# Altium schematic sheet Altium Images.SchDoc
size Letter; SheetNumber: 7; SheetTotal: 7
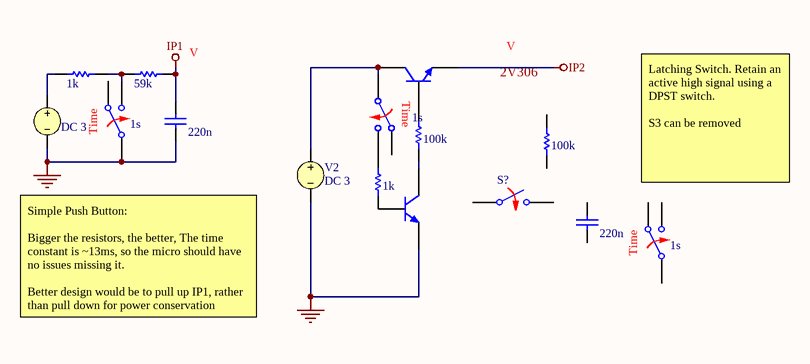
[diagram p0: Altium Images.SchDoc]

## Parts
(Parts that share a designator on the sheet are numbered #1, #2 ... from top to bottom, then left to right.)
C1  value 220n  (hidden comment: Capacitor)
C2  value 220n  (hidden comment: Capacitor)
Q1  Bipolar NPN 3 Pins Transistor VBIC Model  (value not drawn)
Q2  Bipolar NPN 3 Pins Transistor VBIC Model  (value not drawn)
R1  value 1k  (hidden comment: Resistor)
R2  value 59k  (hidden comment: Resistor)
R3  value 100k  (hidden comment: Resistor)
R4  value 100k  (hidden comment: Resistor)
R5  value 1k  (hidden comment: Resistor)
S2  ttran: 1s  (hidden comment: Time Controlled Switch)
S3  ttran: 1s  (hidden comment: Time Controlled Switch)
S?#1  ttran: 1s  (hidden comment: Time Controlled Switch)
S?#2  Switch Normally Opened  (value not drawn)
V1  DC 3
V2  DC 3

## Nets
GND: C1.1 Q2.3(E) S?#1.1 V1.2 V2.2
IP1: C1.2 R2.1
IP2: Q1.3(E)
NetQ1_1: Q1.1(C) S2.1 V2.1
NetQ1_2: Q1.2(B) R3.2
NetQ2_1: Q2.1(C) R3.1
NetQ2_2: Q2.2(B) R5.2
NetR1_1: R1.1 R2.2 S?#1.2
NetR1_2: R1.2 V1.1
NetR5_1: R5.1 S2.2

Not connected (* = marked no-connect by the designer): C2 1 2; R4 1 2; S2 3; S3 1 2 3; S?#1 3; S?#2 1 2

## Notes on the sheet
- 2V306
- Latching Switch. Retain an active high signal using a DPST switch.
  S3 can be removed
- Simple Push Button:
  Bigger the resistors, the better, The time constant is ~13ms, so the micro should have no issues missing it.
  Better design would be to pull up IP1, rather than pull down for power conservation
- (in symbol Time Controlled SW) Time

## Library data of the parts
C1 C2 = Capacitor: SimulationGenericComponent: True
Q1 Q2 = BJT NPN VBIC: SimulationGenericComponent: True; AFN: 1; AJC: -0.5; ART: 0.1; AVC1: 0; EA: 1.12; FC: 0.9; IBBE: 1e-06; IBCI: 1e-16; IBEI: 1e-18; MC: 0.33; NCN: 2; NKF: 0.5; PC: 0.75; TNOM: 27; VERS: 1.2; XII: 3; AJE: -0.5; AJS: -0.5; AVC2: 0; BFN: 1; CBCO: 0; CBEO: 0; CCSO: 0; CJC: 0; CJCP: 0; CJE: 0; CJEP: 0; CTH: 0; DEAR: 0; EAIC: 1.12; EAIE: 1.12; EAIS: 1.12; EANC: 1.12; EANE: 1.12; EANS: 1.12; EAP: 1.12; EBBE: 0; GAMM: 0; HRCF: 1; IBCIP: 0; IBCN: 0; IBCNP: 0; IBEIP: 0; IBEN: 0; IBENP: 0; IKF: 0; IKP: 0; IKR: 0; IS: 1e-16; ISP: 0; ISRR: 1; ITF: 0; KFN: 0; ME: 0.33; MS: 0.33; NBBE: 1; NCI: 1; NCIP: 1; NCNP: 2; NEI: 1; NEN: 2; NF: 1; NFP: 1; NR: 1; PE: 0.75; PS: 0.75; QBM: 0; QCO: 0; QTF: 0; RBI: 0.1; RBP: 0.1; RBX: 0; RCI: 0.1; RCX: 0; RE: 0; RS: 0; RTH: 0; TAVC: 0; TD: 0; TF: 0; TNBBE: 0; TNF: 0; TR: 0; TVBBE1: 0; TVBBE2: 0; VBBE: 0; VEF: 0; VER: 0; VO: 0; VREF: 0; VRT: 0; VTF: 0; WBE: 1; WSP: 1; XIKF: 0; XIN: 3; XIS: 3; XISR: 0; XRBI: 0; XRBP: 0; XRBX: 0; XRCI: 0; XRCX: 0; XRE: 0; XRS: 0; XTF: 0; XVO: 0
R1-R5 = Resistor: TC1: 0; SimulationGenericComponent: True; TC2: 0
S2 S3 S?#1 = Time Controlled SW: Rclosed: 1m; Ropen: 1Meg; tSwitch: 0; SimulationGenericComponent: True
S?#2 = SW NO: closed: 0; Rclosed: 1m; Ropen: 1Meg; SimulationGenericComponent: True
V1 V2 = VSRC: Voltage Source; Note: PCB Footprint - Not required; AC Magnitude: 1; AC Phase: 0; Value: 3; Published: 8-Jun-2000; LatestRevisionDate: 17-Jul-2002; LatestRevisionNote: Re-released for DXP Platform.; PackageReference: Not Applicable; Publisher: Altium Limited